# EasyEDA schematic easyeda_prj.json
TITLE: ledbox; REV: 1.0; Date: 2020-05-22; Sheet: 1/1; Drawn By: ivgiuliani; Company: n/a
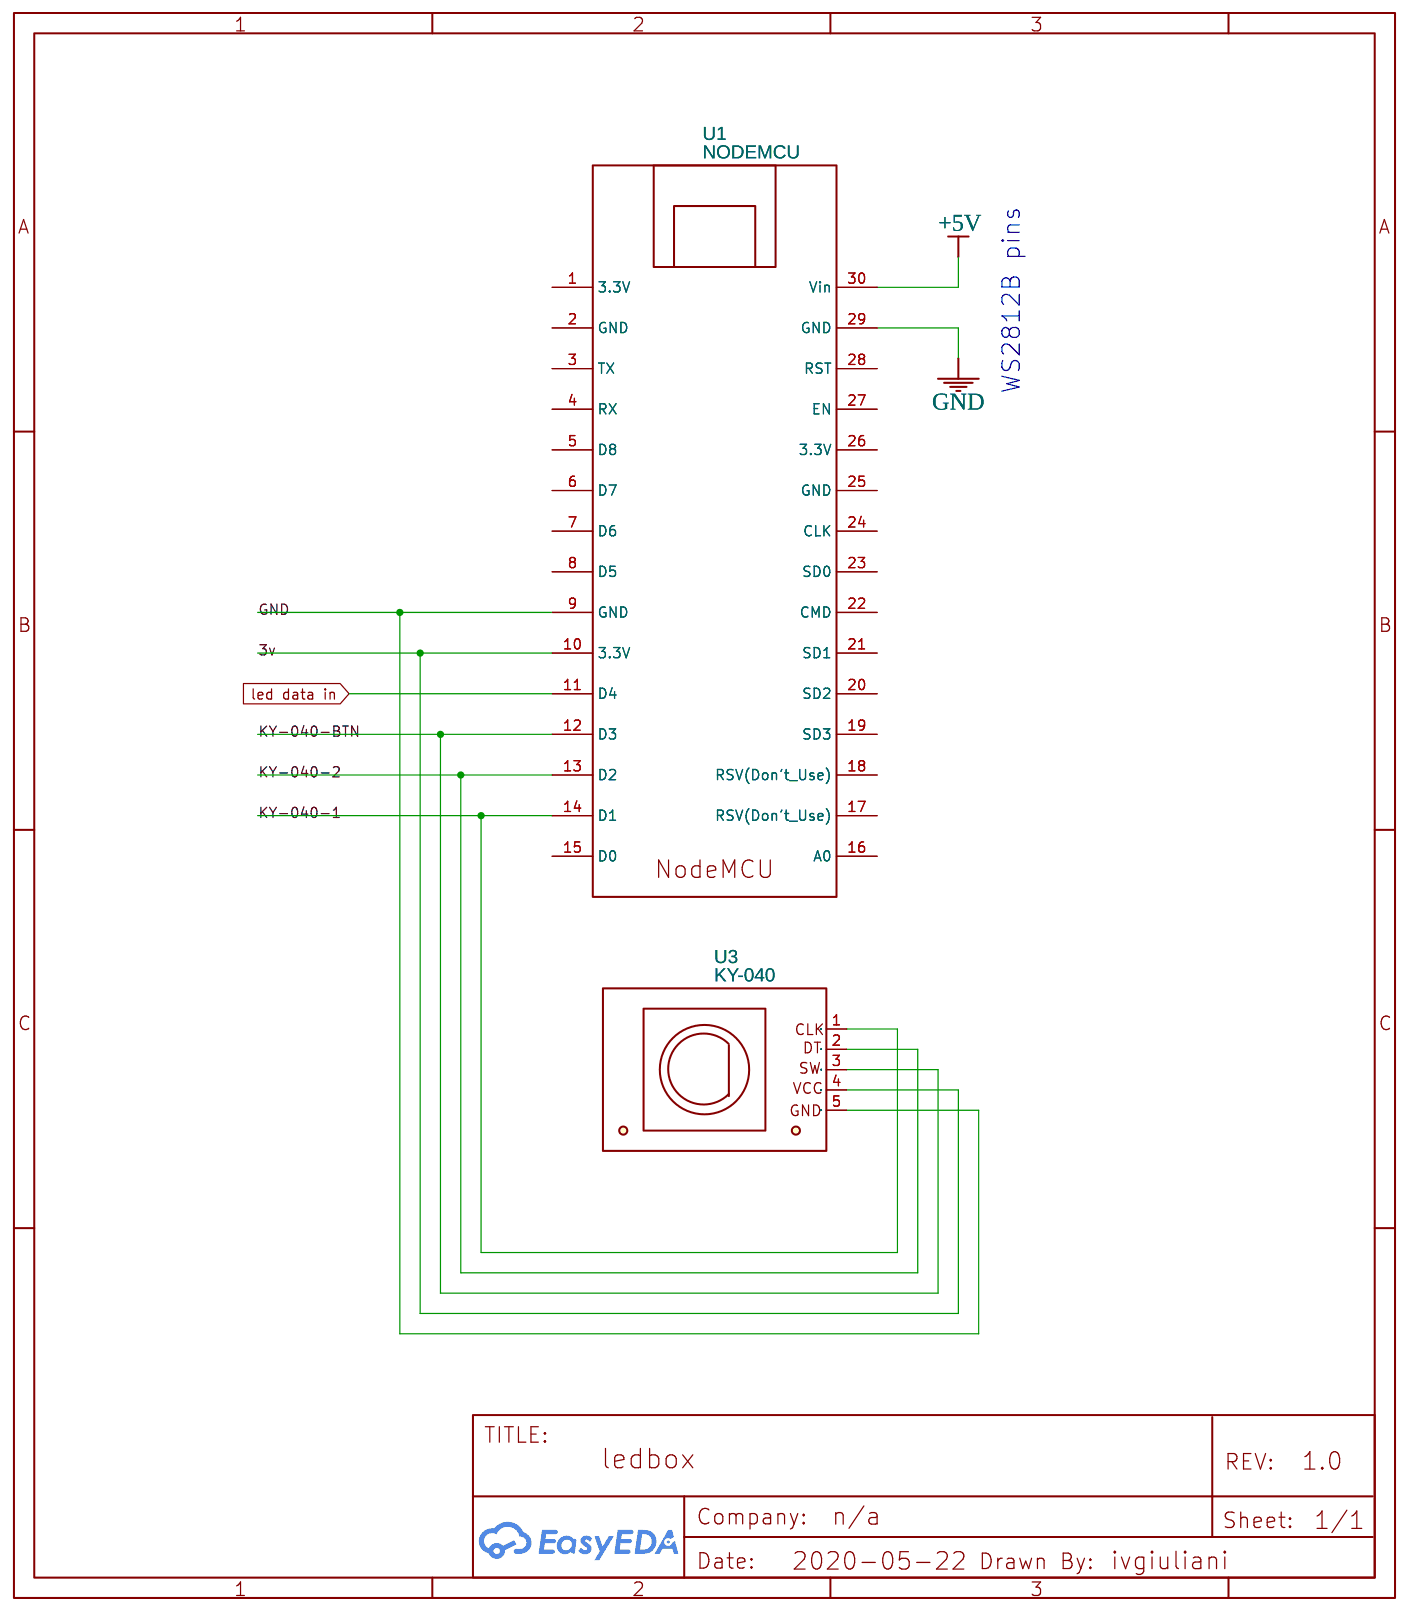
[diagram p0: schematic sheet]

## Parts
U1  NODEMCU  [ESP12E_DEVKIT-V1]
U3  KY-040  [ENCODER_ROTARY_POT_KY-040_SPODNI]

## Library data of the parts
U1 = NODEMCU: Contributor: Milinda Bandara; sourceId: OGtr1ZXUS; sim: true; Package Display: No
U3 = KY-040: Contributor: elmiko

## Nets
3v: U1.10(3.3V) U3.4(VCC)
+5V: U1.30(Vin)
GND: U1.9(GND) U1.29(GND) U3.5(GND)
KY-040-1: U1.14(D1) U3.1(CLK)
KY-040-2: U1.13(D2) U3.2(DT)
KY-040-BTN: U1.12(D3) U3.3(SW)
led data in: U1.11(D4)

Not connected (* = marked no-connect by the designer): U1 1(3.3V) 2(GND) 3(TX) 4(RX) 5(D8) 6(D7) 7(D6) 8(D5) 15(D0) 16(A0) 17(RSV(Don't Use)) 18(RSV(Don't Use)) 19(SD3) 20(SD2) 21(SD1) 22(CMD) 23(SD0) 24(CLK) 25(GND) 26(3.3V) 27(EN) 28(RST)

## Notes on the sheet
- WS2812B pins
